# Altium schematic sheet 05 LAN7800.SchDoc: LAN7800
size 420 x 297 mm; SheetNumber: 5; SheetTotal: 6
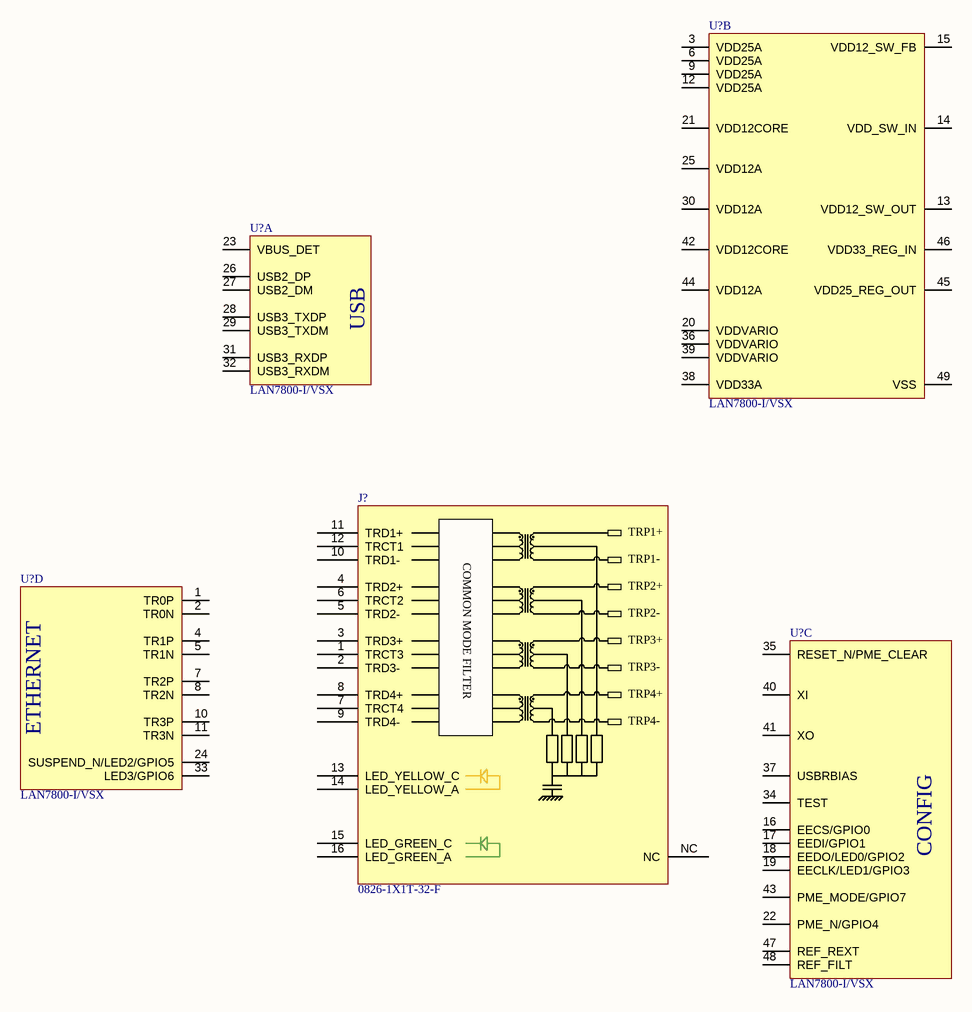
[diagram p0: 05 LAN7800.SchDoc]

## Parts
(Parts that share a designator on the sheet are numbered #1, #2 ... from top to bottom, then left to right.)
J?  0826-1X1T-32-F  [0826-1X1T-32-F]
U?#1  LAN7800-I/VSX  (part A of 4)
U?#2  LAN7800-I/VSX  (part B of 4)
U?#3  LAN7800-I/VSX  (part D of 4)
U?#4  LAN7800-I/VSX  (part C of 4)

## Nets

Not connected (* = marked no-connect by the designer): J? 1(TRCT3) 2(TRD3-) 3(TRD3+) 4(TRD2+) 5(TRD2-) 6(TRCT2) 7(TRCT4) 8(TRD4+) 9(TRD4-) 10(TRD1-) 11(TRD1+) 12(TRCT1) 13(LED_YELLOW_C) 14(LED_YELLOW_A) 15(LED_GREEN_C) 16(LED_GREEN_A) NC; U?#1 23(VBUS_DET) 26(USB2_DP) 27(USB2_DM) 28(USB3_TXDP) 29(USB3_TXDM) 31(USB3_RXDP) 32(USB3_RXDM); U?#2 3(VDD25A) 6(VDD25A) 9(VDD25A) 12(VDD25A) 13(VDD12_SW_OUT) 14(VDD_SW_IN) 15(VDD12_SW_FB) 20(VDDVARIO) 21(VDD12CORE) 25(VDD12A) 30(VDD12A) 36(VDDVARIO) 38(VDD33A) 39(VDDVARIO) 42(VDD12CORE) 44(VDD12A) 45(VDD25_REG_OUT) 46(VDD33_REG_IN) 49(VSS); U?#3 1(TR0P) 2(TR0N) 4(TR1P) 5(TR1N) 7(TR2P) 8(TR2N) 10(TR3P) 11(TR3N) 24(SUSPEND_N/LED2/GPIO5) 33(LED3/GPIO6); U?#4 16(EECS/GPIO0) 17(EEDI/GPIO1) 18(EEDO/LED0/GPIO2) 19(EECLK/LED1/GPIO3) 22(PME_N/GPIO4) 34(TEST) 35(RESET_N/PME_CLEAR) 37(USBRBIAS) 40(XI) 41(XO) 43(PME_MODE/GPIO7) 47(REF_REXT) 48(REF_FILT)

## Notes on the sheet
- Title
- Project
- Size
- Date
- Revision
- A3
- Designed By
- (in symbol 0826-1X1T-32-F) TRP1+; COMMON MODE FILTER; TRP1-; TRP2+; TRP2-; TRP3+; TRP3-; TRP4+; TRP4-
- (in symbol LAN7800-I/VSX, part A) USB
- (in symbol LAN7800-I/VSX, part C) CONFIG
- (in symbol LAN7800-I/VSX, part D) ETHERNET

## Library data of the parts
J? = 0826-1X1T-32-F: 1 Port RJ45Through Hole 10/100/1000 Base-T, AutoMDIX; manufacturer: Bel Fuse Inc.; mfr_part_number: 0826-1X1T-32-F; assembler_number: 0826-1X1T-32-F; datasheet: https://www.belfuse.com/resources/drawings/magneticsolutions/dr-mag-0826-1x1t-32-f.pdf
U?#1-U?#4 = LAN7800-I/VSX: Ethernet Controller 10/100/1000 Base-TX PHY Interface 48-SQFN (6x6); manufacturer: Microchip Technology; mfr_part_number: LAN7800-I/VSX; assembler_number: LAN7800-I/VSX; datasheet: https://ww1.microchip.com/downloads/en/DeviceDoc/LAN7800-Data-Sheet-DS00001992G.pdf